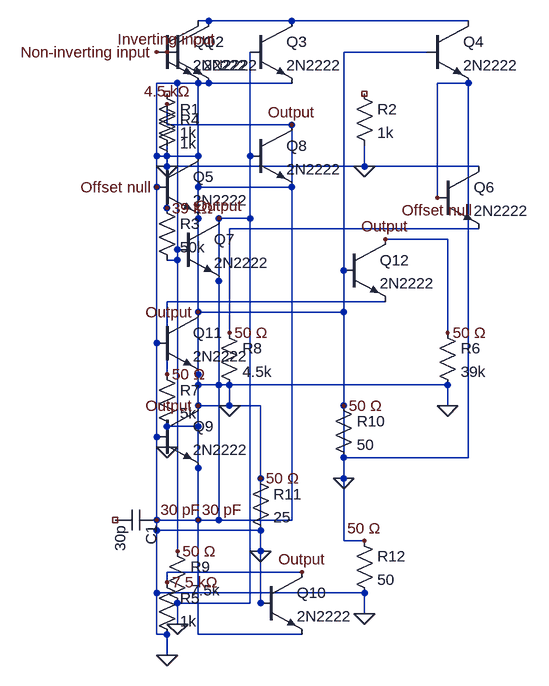
[diagram p0: schematic 25.asc]
25.asc, the LTspice schematic file:
Version 4
SHEET 1 1540 980
SYMBOL npn 64 64 R0
SYMATTR InstName Q1
SYMATTR Value 2N2222
SYMBOL npn 80 64 R0
SYMATTR InstName Q2
SYMATTR Value 2N2222
SYMBOL npn 208 64 R0
SYMATTR InstName Q3
SYMATTR Value 2N2222
SYMBOL npn 480 64 R0
SYMATTR InstName Q4
SYMATTR Value 2N2222
SYMBOL npn 64 272 R0
SYMATTR InstName Q5
SYMATTR Value 2N2222
SYMBOL npn 496 288 R0
SYMATTR InstName Q6
SYMATTR Value 2N2222
SYMBOL npn 96 368 R0
SYMATTR InstName Q7
SYMATTR Value 2N2222
SYMBOL npn 208 224 R0
SYMATTR InstName Q8
SYMATTR Value 2N2222
SYMBOL npn 64 656 R0
SYMATTR InstName Q9
SYMATTR Value 2N2222
SYMBOL npn 224 912 R0
SYMATTR InstName Q10
SYMATTR Value 2N2222
SYMBOL npn 64 512 R0
SYMATTR InstName Q11
SYMATTR Value 2N2222
SYMBOL npn 352 400 R0
SYMATTR InstName Q12
SYMATTR Value 2N2222
SYMBOL res 64 160 R0
SYMATTR InstName R1
SYMATTR Value 1k
SYMBOL res 368 160 R0
SYMATTR InstName R2
SYMATTR Value 1k
SYMBOL res 64 336 R0
SYMATTR InstName R3
SYMATTR Value 50k
SYMBOL res 64 176 R0
SYMATTR InstName R4
SYMATTR Value 1k
SYMBOL res 64 912 R0
SYMATTR InstName R5
SYMATTR Value 1k
SYMBOL res 496 528 R0
SYMATTR InstName R6
SYMATTR Value 39k
SYMBOL res 64 592 R0
SYMATTR InstName R7
SYMATTR Value 5k
SYMBOL res 160 528 R0
SYMATTR InstName R8
SYMATTR Value 4.5k
SYMBOL res 80 864 R0
SYMATTR InstName R9
SYMATTR Value 7.5k
SYMBOL res 336 640 R0
SYMATTR InstName R10
SYMATTR Value 50
SYMBOL res 208 752 R0
SYMATTR InstName R11
SYMATTR Value 25
SYMBOL res 368 848 R0
SYMATTR InstName R12
SYMATTR Value 50
SYMBOL cap 64 816 R90
SYMATTR InstName C1
SYMATTR Value 30p
WIRE 64 112 80 112
WIRE 128 64 272 64
WIRE 144 64 544 64
WIRE 272 160 64 160
WIRE 64 160 64 320
WIRE 544 160 496 160
WIRE 496 160 496 336
WIRE 128 272 80 272
WIRE 80 272 80 352
WIRE 560 288 80 288
WIRE 80 288 80 352
WIRE 80 432 96 432
WIRE 96 432 96 416
WIRE 160 368 208 368
WIRE 208 368 208 272
WIRE 272 224 80 224
WIRE 80 224 80 192
WIRE 80 272 64 272
WIRE 64 272 64 704
WIRE 128 656 224 656
WIRE 224 656 224 960
WIRE 288 912 80 912
WIRE 80 912 80 928
WIRE 80 1008 64 1008
WIRE 64 1008 64 560
WIRE 128 512 352 512
WIRE 352 512 352 448
WIRE 416 400 512 400
WIRE 512 400 512 544
WIRE 512 624 160 624
WIRE 160 624 160 464
WIRE 272 320 128 320
WIRE 128 320 128 752
WIRE 288 1008 128 1008
WIRE 128 1008 128 608
WIRE 416 496 80 496
WIRE 80 496 80 608
WIRE 80 688 128 688
WIRE 128 688 128 368
WIRE 560 384 176 384
WIRE 176 384 176 544
WIRE 176 624 128 624
WIRE 128 624 128 160
WIRE 144 160 96 160
WIRE 96 160 96 880
WIRE 96 960 208 960
WIRE 208 960 208 112
WIRE 480 112 352 112
WIRE 352 112 352 656
WIRE 352 736 544 736
WIRE 544 736 544 160
WIRE 224 768 224 960
WIRE 224 848 64 848
WIRE 64 848 64 560
WIRE 384 864 352 864
WIRE 352 864 352 448
WIRE 384 944 64 944
WIRE 64 944 64 704
WIRE 64 832 160 832
WIRE 160 832 160 368
WIRE 128 832 272 832
WIRE 272 832 272 224
WIRE 80 256 80 288
WIRE 384 256 384 288
WIRE 80 1008 80 1040
WIRE 512 624 512 656
WIRE 80 688 80 720
WIRE 176 624 176 656
WIRE 96 960 96 992
WIRE 352 736 352 768
WIRE 224 848 224 880
WIRE 384 944 384 976
FLAG 80 288 0
FLAG 384 288 0
FLAG 80 1040 0
FLAG 512 656 0
FLAG 80 720 0
FLAG 176 656 0
FLAG 96 992 0
FLAG 352 768 0
FLAG 224 880 0
FLAG 384 976 0
FLAG 64 112 Non-inverting input
FLAG 80 112 Inverting input
FLAG 64 320 Offset null
FLAG 496 336 Offset null
FLAG 160 368 Output
FLAG 272 224 Output
FLAG 128 656 Output
FLAG 288 912 Output
FLAG 128 512 Output
FLAG 416 400 Output
FLAG 80 352 39 kΩ
FLAG 80 192 4.5 kΩ
FLAG 80 928 7.5 kΩ
FLAG 512 544 50 Ω
FLAG 80 608 50 Ω
FLAG 176 544 50 Ω
FLAG 96 880 50 Ω
FLAG 352 656 50 Ω
FLAG 224 768 50 Ω
FLAG 384 864 50 Ω
FLAG 64 832 30 pF
FLAG 128 832 30 pF

The netlist it stands for:
* 25.asc
Q1 N001 Inverting input 0 0 2N2222
Q2 N001 Inverting input 0 0 2N2222
Q3 N001 0 0 0 2N2222
Q4 N001 0 0 0 2N2222
Q5 0 0 0 0 2N2222
Q6 0 0 0 0 2N2222
Q7 0 0 0 0 2N2222
Q8 0 0 0 0 2N2222
Q9 0 0 0 0 2N2222
Q10 0 0 0 0 2N2222
Q11 0 0 0 0 2N2222
Q12 0 0 0 0 2N2222
R1 NC_01 0 1k
R2 NC_02 0 1k
R3 0 0 50k
R4 0 0 1k
R5 0 0 1k
R6 0 0 39k
R7 0 0 5k
R8 0 0 4.5k
R9 0 0 7.5k
R10 0 0 50
R11 0 0 25
R12 0 0 50
C1 0 NC_03 30p
.model NPN NPN
.model PNP PNP
.lib standard.bjt
.backanno
.end